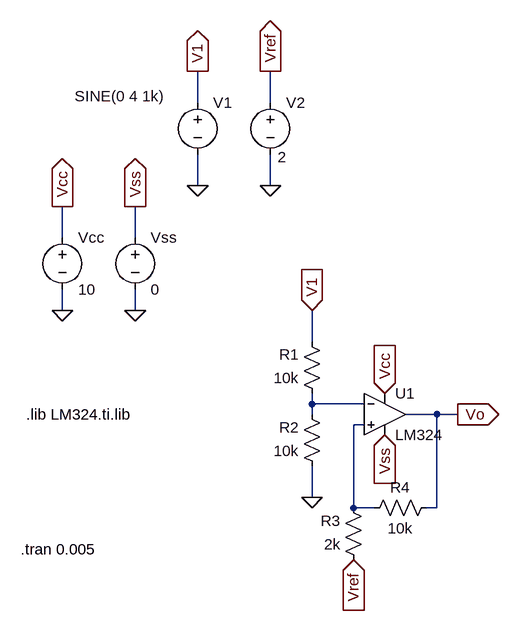
[diagram p0: schematic Circuito4.asc]
Circuito4.asc, the LTspice schematic file:
Version 4.1
SHEET 1 880 680
WIRE -336 -320 -336 -368
WIRE -224 -320 -224 -368
WIRE -336 -192 -336 -240
WIRE -224 -192 -224 -240
WIRE -544 -112 -544 -160
WIRE -432 -112 -432 -160
WIRE -544 0 -544 -32
WIRE -432 0 -432 -32
WIRE -160 48 -160 0
WIRE -160 144 -160 128
WIRE -80 144 -160 144
WIRE -160 160 -160 144
WIRE 32 160 -16 160
WIRE 64 160 32 160
WIRE -80 176 -96 176
WIRE -160 288 -160 240
WIRE -96 304 -96 176
WIRE -64 304 -96 304
WIRE 32 304 32 160
WIRE 32 304 16 304
FLAG -160 0 V1
IOPIN -160 0 In
FLAG -48 128 Vcc
IOPIN -48 128 In
FLAG -48 192 Vss
IOPIN -48 192 In
FLAG 64 160 Vo
IOPIN 64 160 Out
FLAG -160 288 0
FLAG -544 0 0
FLAG -432 0 0
FLAG -544 -160 Vcc
IOPIN -544 -160 Out
FLAG -432 -160 Vss
IOPIN -432 -160 Out
FLAG -336 -368 V1
IOPIN -336 -368 Out
FLAG -224 -368 Vref
IOPIN -224 -368 Out
FLAG -336 -192 0
FLAG -224 -192 0
FLAG -96 384 Vref
IOPIN -96 384 In
SYMBOL OpAmps\\opamp2 -48 96 R0
SYMATTR InstName U1
SYMATTR Value LM324
SYMBOL res -144 144 R180
WINDOW 0 36 76 Left 2
WINDOW 3 36 40 Left 2
SYMATTR InstName R1
SYMATTR Value 10k
SYMBOL res -144 256 R180
WINDOW 0 36 76 Left 2
WINDOW 3 36 40 Left 2
SYMATTR InstName R2
SYMATTR Value 10k
SYMBOL res -80 400 R180
WINDOW 0 36 76 Left 2
WINDOW 3 36 40 Left 2
SYMATTR InstName R3
SYMATTR Value 2k
SYMBOL res -80 320 R270
WINDOW 0 32 56 VTop 2
WINDOW 3 0 56 VBottom 2
SYMATTR InstName R4
SYMATTR Value 10k
SYMBOL voltage -544 -128 R0
SYMATTR InstName Vcc
SYMATTR Value 10
SYMBOL voltage -432 -128 R0
SYMATTR InstName Vss
SYMATTR Value 0
SYMBOL voltage -336 -336 R0
WINDOW 3 -189 6 Left 2
WINDOW 123 0 0 Left 0
WINDOW 39 0 0 Left 0
SYMATTR Value SINE(0 4 1k)
SYMATTR InstName V1
SYMBOL voltage -224 -336 R0
WINDOW 3 11 100 Left 2
WINDOW 123 0 0 Left 0
WINDOW 39 0 0 Left 0
SYMATTR Value 2
SYMATTR InstName V2
TEXT -600 160 Left 2 !.lib LM324.ti.lib
TEXT -608 368 Left 2 !.tran 0.005

The netlist it stands for:
* Circuito4.asc
X§U1 N002 N001 Vcc Vss Vo LM324  ; pins In+ In- V+ V- OUT
R1 N001 V1 10k
R2 0 N001 10k
R3 Vref N002 2k
R4 N002 Vo 10k
Vcc Vcc 0 10
Vss Vss 0 0
V1 V1 0 SINE(0 4 1k)
V2 Vref 0 2
.lib LM324.ti.lib
.tran 0.005
.backanno
.end